# Altium schematic sheet Sheet1.SchDoc
size A4; SheetNumber: 1; SheetTotal: 1
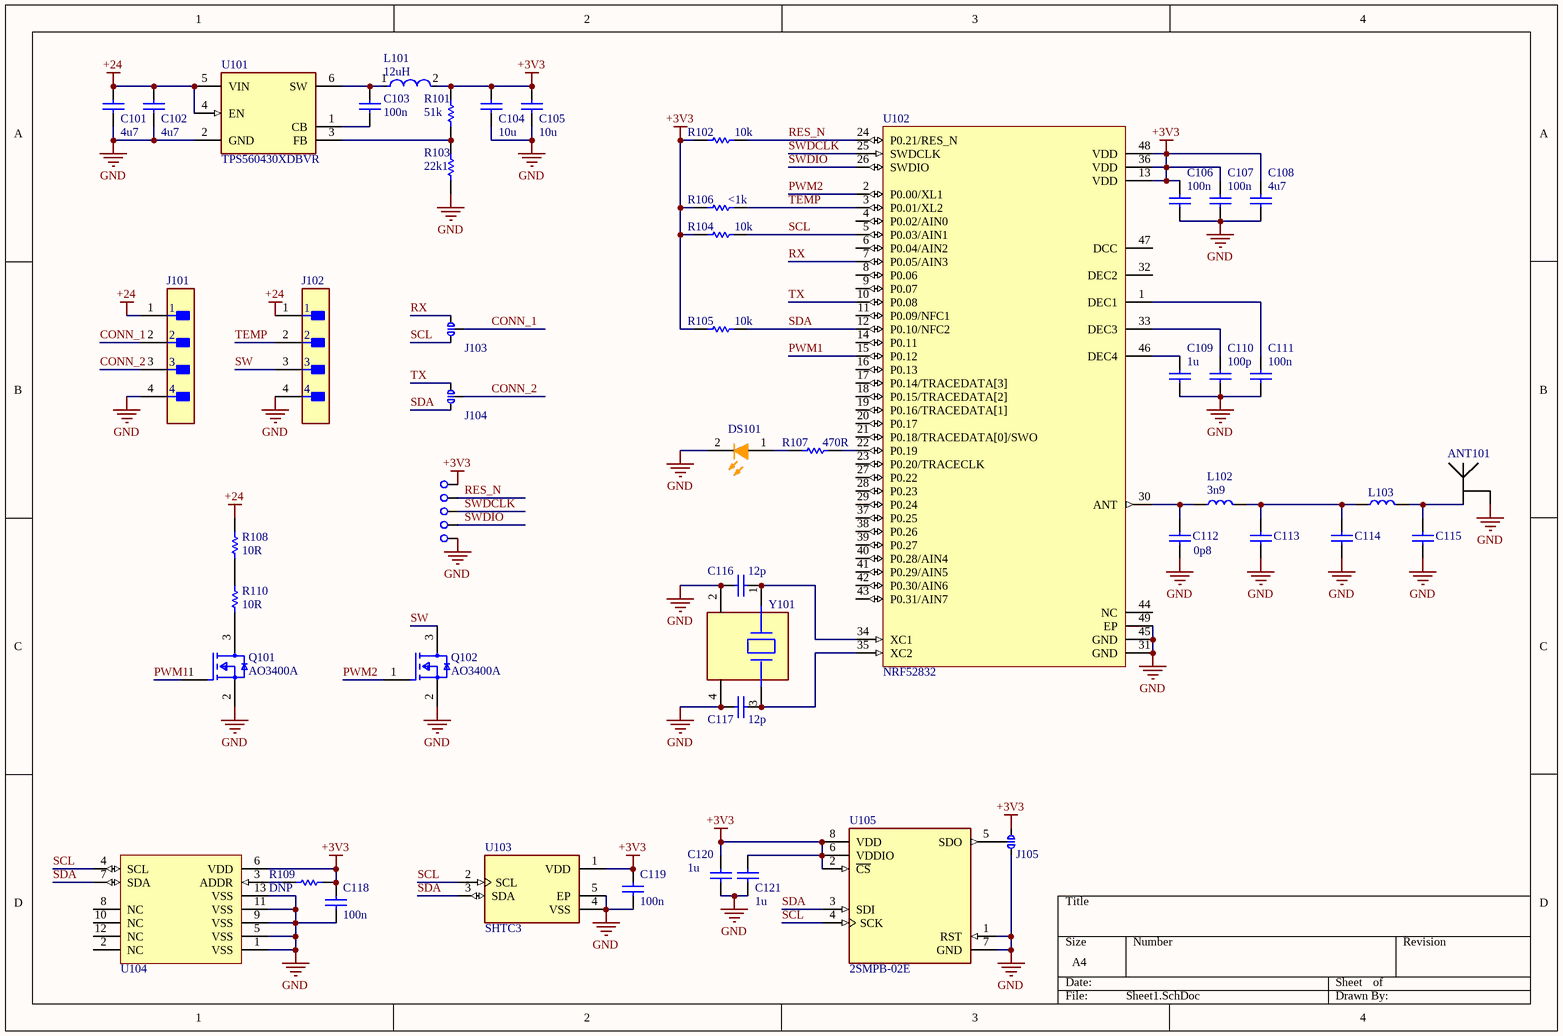
[diagram p0: Sheet1.SchDoc]

## Parts
ANT101  BT_ANT  [INV_F_2.4_50R2L08mm]  (value not drawn)
C101  4u7  [CAPC2013X13N]
C102  4u7  [CAPC2013X13N]
C103  100n  [CAPC1608X09N]
C104  10u  [CAPC2013X13N]
C105  10u  [CAPC2013X13N]
C106  100n  [CAPC1608X09N]
C107  100n  [CAPC1608X09N]
C108  4u7  [CAPC1608X09N]
C109  1u  [CAPC1608X09N]
C110  100p  [CAPC1608X09N]
C111  100n  [CAPC1608X09N]
C112  0p8  [CAPC1608X09N]
C113  Capacitor  [CAPC1608X09N]  (value not drawn)
C114  Capacitor  [CAPC1608X09N]  (value not drawn)
C115  Capacitor  [CAPC1608X09N]  (value not drawn)
C116  12p  [CAPC1608X09N]
C117  12p  [CAPC1608X09N]
C118  100n  [CAPC1608X09N]
C119  100n  [CAPC1608X09N]
C120  1u  [CAPC1608X09N]
C121  1u  [CAPC1608X09N]
DS101  KP-1608SECK  [KING-0603LED_ORANGE_V]  (value not drawn)
J101  B4B-PH-K(LF)(SN)  [FP-B4B-PH-K_LF_SN-MFG]  (value not drawn)
J102  B4B-PH-K(LF)(SN)  [FP-B4B-PH-K_LF_SN-MFG]  (value not drawn)
J103  Solder Jumper  [Solderbridge_3Way_New]  (value not drawn)
J104  Solder Jumper  [Solderbridge_3Way_New]  (value not drawn)
J105  Solder Jumper  [Solderbridge_3Way_New]  (value not drawn)
L101  12uH  [FP-SRP4020TA-MFG]
L102  3n9  [INDC1608X06N]
L103  Inductor  [INDC1608X06N]  (value not drawn)
Q101  AO3400A  [FP-SOT23-MFG]
Q102  AO3400A  [FP-SOT23-MFG]
R101  51k  [RESC1608X06N]
R102  10k  [RESC1608X06N]
R103  22k1  [RESC1608X06N]
R104  10k  [RESC1608X06N]
R105  10k  [RESC1608X06N]
R106  <1k  [RESC1608X06N]
R107  470R  [RESC1608X06N]
R108  10R  [TO508P344X1041X2058-2P_FLAT]
R109  DNP  [RESC1608X06N]
R110  10R  [TO508P344X1041X2058-2P_FLAT]
TP101  TestPoint  [TestPoint_3mm]  (value not drawn)
TP102  TestPoint  [TestPoint_3mm]  (value not drawn)
TP103  TestPoint  [TestPoint_3mm]  (value not drawn)
TP104  TestPoint  [TestPoint_3mm]  (value not drawn)
TP105  TestPoint  [TestPoint_3mm]  (value not drawn)
U101  TPS560430XDBVR  [FP-DBV0006A-MFG]
U102  NRF52832  [QFN40P600X600X85_HS-49N]
U103  SHTC3  [FP-SHTC3-MFG]
U104  Smart CO2 sensor based on thermal conductivity  [QFN80P300X350X110_HS-13N]  (value not drawn)
U105  2SMPB-02E  [FP-2SMPB-02E-MFG]
Y101  3225 XO 32MHz  [FP-TSX-3225-MFG]  (value not drawn)

## Nets
+3V3: C104.2 C105.2 C106.2 C107.2 C108.2 C118.2 C119.2 C120.2 C121.2 J105.2 L101.2 R101.2 R102.2 R104.2 R105.2 R106.2 R109.2 TP105.TP U102.13(VDD) U102.36(VDD) U102.48(VDD) U103.1(VDD) U104.6(VDD) U105.2(~{CS}) U105.6(VDDIO) U105.8(VDD)
+24: C101.2 C102.2 J101.1 J102.1 R108.2 U101.4(EN) U101.5(VIN)
GND: ANT101.2(GND) C101.1 C102.1 C104.1 C105.1 C106.1 C107.1 C108.1 C109.1 C110.2 C111.2 C112.1 C113.1 C114.1 C115.1 C116.1 C117.1 C118.1 C119.1 C120.1 C121.1 DS101.2(K) J101.4 J102.4 J105.1 Q101.2(S) Q102.2(S) R103.1 TP104.TP U101.2(GND) U102.31(GND) U102.45(GND) U102.49(EP) U103.4(VSS) U103.5(EP) U104.1(VSS) U104.5(VSS) U104.9(VSS) U104.11(VSS) U104.13(VSS) U105.1(RST) U105.7(GND) Y101.2(GND) Y101.4(GND)
CONN_1: J101.2 J103.3
CONN_2: J101.3 J104.3
PWM1: Q101.1(G) U102.15(P0.12)
PWM2: Q102.1(G) U102.2(P0.00/XL1)
RES_N: R102.1 TP101.TP U102.24(P0.21/RES_N)
RX: J103.1 U102.7(P0.05/AIN3)
SCL: J103.2 R104.1 U102.5(P0.03/AIN1) U103.2(SCL) U104.4(SCL) U105.4(SCK)
SDA: J104.2 R105.1 U102.12(P0.10/NFC2) U103.3(SDA) U104.7(SDA) U105.3(SDI)
SW: J102.3 Q102.3(D)
SWDCLK: TP102.TP U102.25(SWDCLK)
SWDIO: TP103.TP U102.26(SWDIO)
TEMP: J102.2 R106.1 U102.3(P0.01/XL2)
TX: J104.1 U102.10(P0.08)
NetANT101_1: ANT101.1(ANT) C115.2 L103.2
NetC103_1: C103.1 U101.1(CB)
NetC103_2: C103.2 L101.1 U101.6(SW)
NetC109_2: C109.2 U102.46(DEC4)
NetC110_1: C110.1 U102.33(DEC3)
NetC111_1: C111.1 U102.1(DEC1)
NetC112_2: C112.2 L102.1 U102.30(ANT)
NetC113_2: C113.2 C114.2 L102.2 L103.1
NetC116_2: C116.2 U102.34(XC1) Y101.1
NetC117_2: C117.2 U102.35(XC2) Y101.3
NetDS101_1: DS101.1(A) R107.2
NetJ105_3: J105.3 U105.5(SDO)
NetQ101_3: Q101.3(D) R110.2
NetR101_1: R101.1 R103.2 U101.3(FB)
NetR107_1: R107.1 U102.22(P0.19)
NetR108_1: R108.1 R110.1
NetR109_1: R109.1 U104.3(ADDR)

Not connected (* = marked no-connect by the designer): U102 4(P0.02/AIN0) 6(P0.04/AIN2) 8(P0.06) 9(P0.07) 11(P0.09/NFC1) 14(P0.11) 16(P0.13) 17(P0.14/TRACEDATA[3]) 18(P0.15/TRACEDATA[2]) 19(P0.16/TRACEDATA[1]) 20(P0.17) 21(P0.18/TRACEDATA[0]/SWO) 23(P0.20/TRACECLK) 27(P0.22) 28(P0.23) 29(P0.24) 32(DEC2) 37(P0.25) 38(P0.26) 39(P0.27) 40(P0.28/AIN4) 41(P0.29/AIN5) 42(P0.30/AIN6) 43(P0.31/AIN7) 44(NC) 47(DCC); U104 2(NC) 8(NC) 10(NC) 12(NC)

## Library data of the parts
C101 C102 C104 C105 = C0805: Capacitor; Value: 1p; Voltage: *; Dielectric: *
C103 C106-C112 C116-C121 = C0603: Capacitor; Value: 1p; Voltage: *; Dielectric: *
C113-C115 = C0603: Value: 1p; Voltage: *; Dielectric: *
DS101 = LED Orange: LED, SMT, 0603(1608), 1.1mm thickness, Orange; Manufacturer: Kingbright; Power Dissipation: 75 mW; Packing Type: 2000 pcs / reel; Reverse Voltage: 5 V; Forward Current: 30 mA; Storage Temperature: -40 to +85 degC; ComponentLink2Description: Datasheet; ComponentLink1URL: http://www.kingbright.com/; Mounting Technology: Surface Mount; ComponentLink2URL: http://www.kingbright.com/manager/upload/pdf/(1366274642)KP-1608SECK(Ver.14A).pdf; PackageDescription: 2-Pin SMT LED, 1.6 x 0.8 mm Pitch; PartNumber: KP-1608SECK; ComponentLink1Description: Manufacturer URL; PackageReference: 0603LED_ORANGE
J101 J102 = CMP-17439-000414-1: CONN HEADER VERT 4POS 2MM; Voltage Rating: 100V; Number of Contacts: 4; Mated Stacking Heights: 8mm; Insulation Color: Beige; Flammability Rating: UL94 V-0; Pitch: 2mm; Packaging: Bulk; Termination: Press-Fit; Contact Mating Length: 0.13inch; Contact Plating: Tin; Contact Finish - Mating: TIN; Connector Type: Header; Fastening Type: Detent; Insulation Material: Nylon; Contact Material: Brass; Contact Shape: Square; Number of Rows: 1; Mount: Through Hole; Lead Free: Lead Free; Housing Color: White; Number of Positions: 4; Series: PH; Contact Type: Male Pin; Color: Beige; Housing Material: Nylon
J103-J105 = Solder Jumper_3Way
L101 = CMP-07248-000008-1: FIXED IND 12UH 2A 76 MOHM SMD; Manufacturer: Bourns; Manufacturer Part Number: SRP4020TA-3R3M; Shielding: true; Test Frequency: 100kHz; Self Resonant Frequency: 40MHz; Saturation Current: 4A; Q Factor: 10; Series Resistance: 76mΩ; Automotive Grade: Grade 0; Core Material: Carbonyl Powder; Inductance: 3.3uH; Tolerance: 20%; Rms Current: 3.5A; Temperature Range High: +150°C; Height: 2.1mm; Temperature: -40°C to +150°C; RoHS: TRUE; Device Class L3: Fixed Inductors; Automotive: Yes; Octopart: https://octopart.com/srp4020ta-3r3m-bourns-47300338; Composition: Wirewound; Mouser Description: Ind Power Shielded Wirewound 3.3uH 20% 100KHz Carbonyl Powder 3.5A T/R; Category: Ind; ComponentLink2Description: Datasheet; ComponentLink2URL: https://www.bourns.com/docs/Product-Datasheets/SRP4020TA.pdf; Digikey Description: FIXED IND 3.3UH 3.5A 76 MOHM SMD; Lead Free: Yes; Temperature Range Low: -40°C; Package: SRP4020TA; Value: 12uH; Device Class L1: Passive Components; Device Class L2: Inductors
L102 = L0603: Inductor; Value: *
L103 = L0603: Value: *
Q101 Q102 = CMP-83955-000006-1: MOSFET N-CH 30V 5.7A SOT23; Input Capacitance: 630pF; Number of Elements: 1; Rds On Max: 26.5mR; Max Power Dissipation: 1.4W; Gate to Source Voltage (Vgs): 12V; Min Operating Temperature: -55°C; Lead Free: Lead Free; Number of Pins: 3; Drain to Source Voltage (Vdss): 30V; Case/Package: SOT-23; Mount: Surface Mount; Continuous Drain Current (ID): 5.7A; Radiation Hardening: No; Packaging: Tape and Reel; Max Operating Temperature: 150°C; Power Dissipation: 1.4W
R101-R107 R109 = R0603: Resistor; Value: *
R108 R110 = MP930: Caddock Power Resistor; Value: *
U101 = CMP-04918-000083-1: IC REG BUCK PFM 600MA SOT23-6; Manufacturer: Texas Instruments; Max Duty Cycle: 98%; Number Of Outputs: 1; Max Supply Voltage: 36V; Output Voltage: 1-24V; Nominal Supply Current: 80uA; Max Junction Temp: +125°C; Standoff Height: 0mm; Min Supply Voltage: 4V; Switching Frequency: 1.1MHz; Output Type: AdjustableProgrammable; Temperature Range High: +125°C; Category: IC; ComponentLink2Description: Datasheet; Manufacturer Part Number: TPS560430XDBVR; Automotive: No; Mouser Description: SIMPLE SWITCHER® 36-V, 600-mA Buck Regulator With High-Efficiency Sleep Mode 6-SOT-23 -40 to 125; RoHS: TRUE; Digikey Description: IC REG BUCK PFM 600MA SOT23-6; Octopart: https://octopart.com/tps560430xdbvr-texas+instruments-93105742; Device Class L3: Voltage Regulators - Switching; Package: DBV0006A; Device Class L2: Power Management ICs; Switching Topology: Buck; Device Class L1: Integrated Circuits (ICs); ComponentLink2URL: http://www.ti.com/lit/ds/symlink/tps560430.pdf; Lead Free: Yes; Output Current: 600mA; Temperature: -40°C to +125°C; Height: 1.45mm; Temperature Range Low: -40°C
U103 = CMP-144040-000003-1: SENSOR HUMI/TEMP I2C 2% SMD; Manufacturer: Sensirion; Operating Supply Current: 0.3-900uA; Resolution: 16bits; Min Supply Voltage: 1.62V; Max Supply Voltage: 3.6V; Category: IC; Device Class L3: unset; ComponentLink2URL: https://www.sensirion.com/fileadmin/user_upload/customers/sensirion/Dokumente/0_Datasheets/Humidity/Sensirion_Humidity_Sensors_SHTC3_Datasheet.pdf; Ipc Land Pattern Name: DFN200X200X75-4; RoHS: TRUE; Height: 0.75mm; Interface: I2C; Temperature Range High: +125°C; Accuracy: 2%; Sensor Output: I2C; Automotive: No; Package: 0; Device Class L1: Sensors; Manufacturer Part Number: SHTC3; Digikey Description: SENSOR HUMI/TEMP I2C 2% SMD; Lead Free: Yes; Temperature: -40°C to +125°C; Device Class L2: Temperature and Humidity Sensors; ComponentLink2Description: Datasheet; Octopart: https://octopart.com/shtc3-sensirion-91912225; Mouser Description: SHTC3 Series 0 to 100% RH 3.6 V Humidity and Temperature Sensor IC - DFN-4; Temperature Range Low: -40°C
U104 = STC31-C
U105 = CMP-08765-000002-1: BAROMETRIC DGTL PRESS SENS 9LGA; Manufacturer: Omron; Port Style: No Port; Min Supply Voltage: 1.2V; Operating Supply Current: 410-640uA; Max Supply Voltage: 3.6V; Sensor Output: I2C,SPI; Temperature Range Low: -40°C; Height: 0.95mm; Lead Free: Yes; Digikey Description: BAROMETRIC DGTL PRESS SENS 9LGA; ComponentLink2Description: Datasheet; Manufacturer Part Number: 2SMPB-02E; Octopart: https://octopart.com/2smpb-02e-omron-87757861; Category: IC; Automotive: No; Temperature: -40°C to +85°C; Temperature Range High: +85°C; Device Class L3: unset; Device Class L1: Sensors; ComponentLink2URL: https://omronfs.omron.com/en_US/ecb/products/pdf/en_2smpb_02e.pdf; Device Class L2: Pressure Sensors; RoHS: TRUE; Package: 2SMPB-02E
Y101 = CMP-36405-000018-1: CRYSTAL 32.0000MHZ 9PF SMD; ESR (Equivalent Series Resistance): 40R; Frequency Stability: 20ppm; Frequency: 24MHz; Tolerance: 10ppm; Drive Level: 200uW; Min Operating Temperature: -40°C; RoHS Compliant: Yes; Width: 2.5mm; Max Operating Temperature: 105°C; Package Quantity: 250; Load Capacitance: 9pF; Mount: Surface Mount; Lead Free: Lead Free; Height: 0.024inch; Depth: 2.5mm; Packaging: Tape and Reel; Series: TSX-3225; Weight: 0.000564oz; Number of Pins: 4; Termination: SMD/SMT; Case/Package: SMD/SMT; Length: 3.2mm; Frequency Tolerance: 10ppm